# EAGLE design bodeplotter_v1 (EAGLE 9.6.2)

## Sheet 1 of 2: Decoupling caps & peripherals
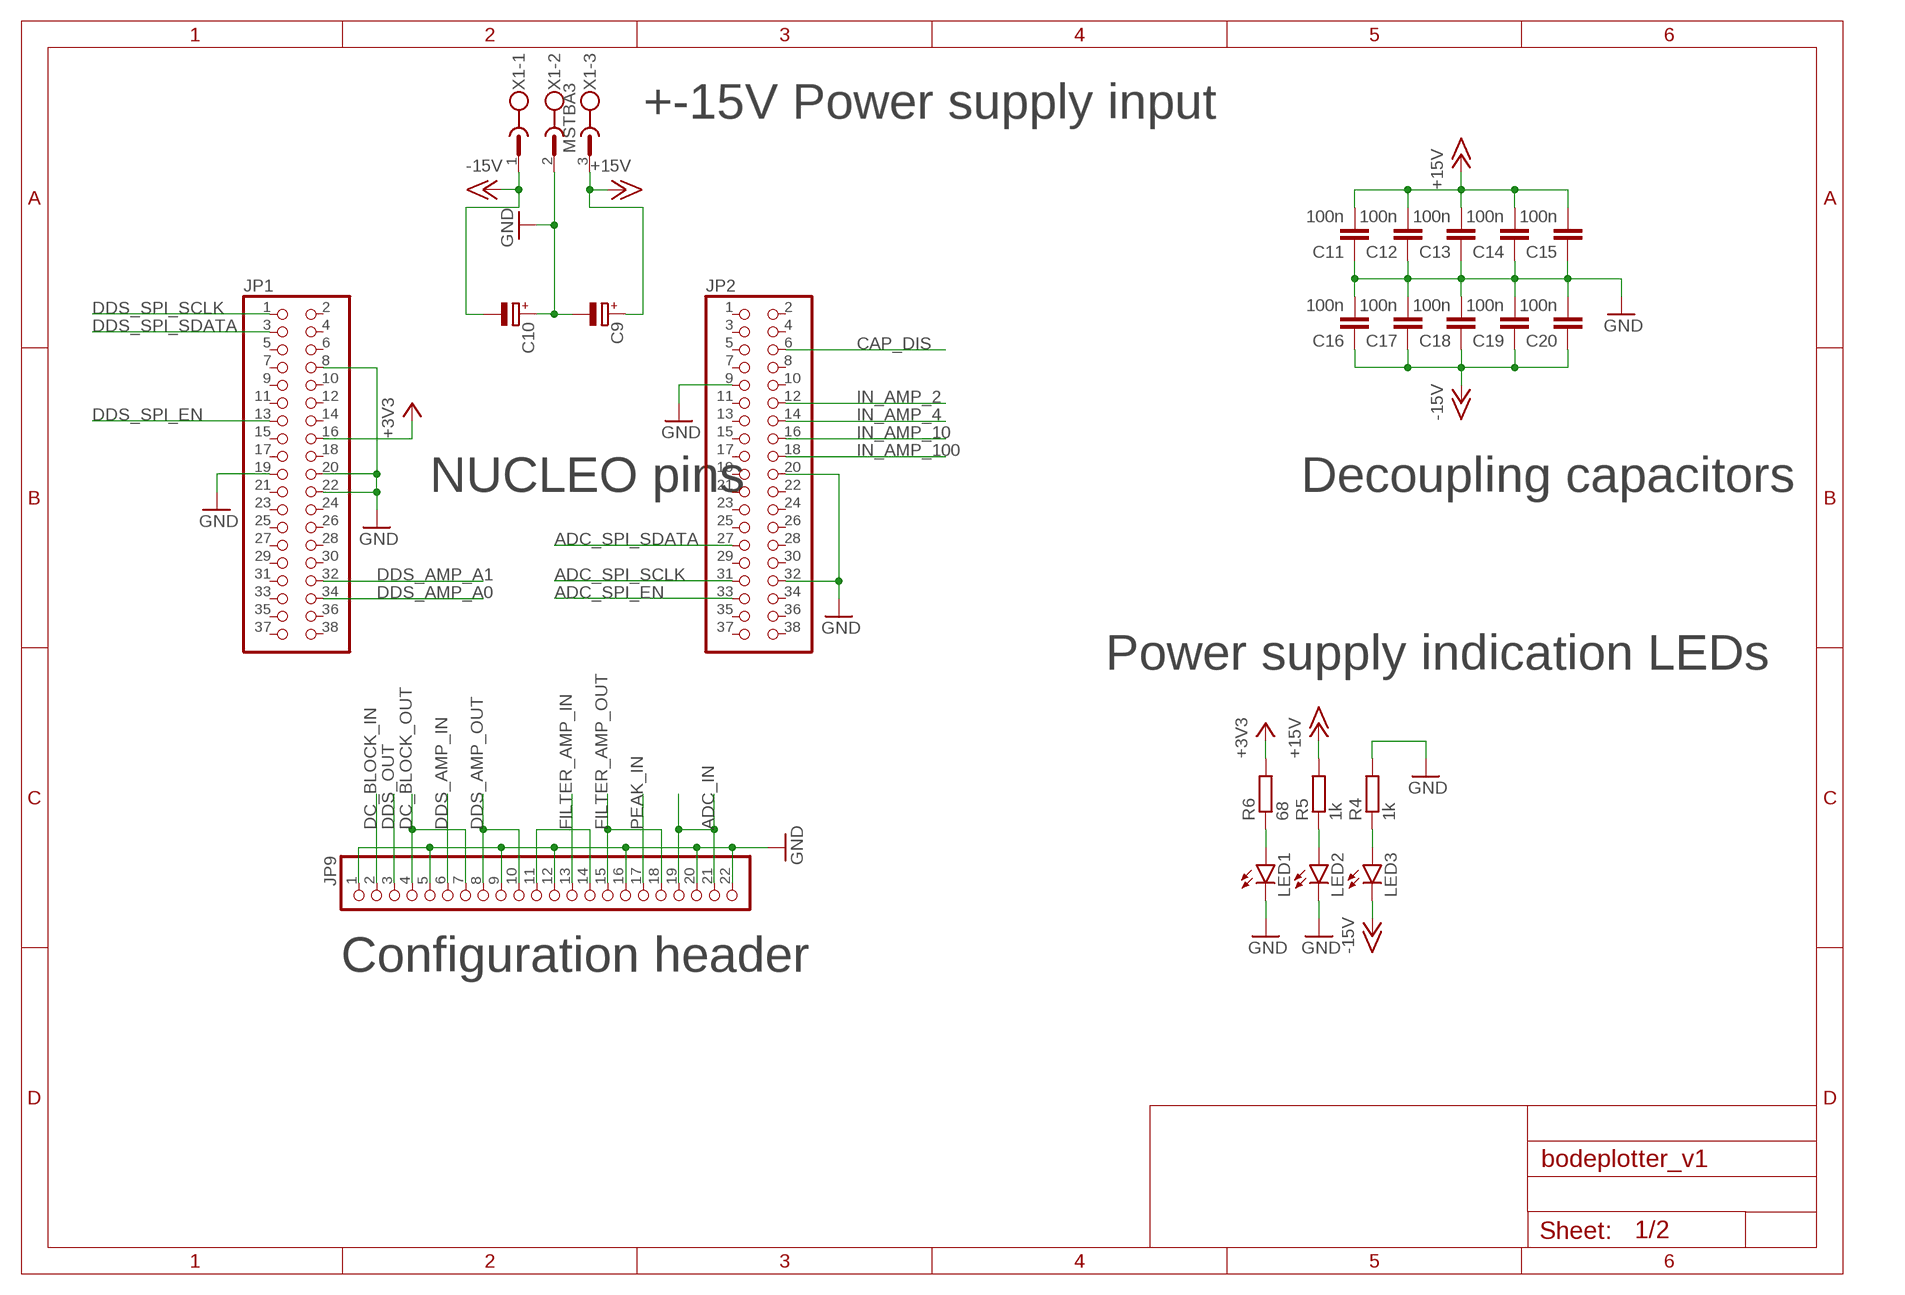
[diagram p0: schematic, sheet 1]

### Parts
C9  CPOL-EU140CLH-0810  [140CLH-0810]
C10  CPOL-EU140CLH-0810  [140CLH-0810]
C11  100n  C-EUC0805  [C0805]
C12  100n  C-EUC0805  [C0805]
C13  100n  C-EUC0805  [C0805]
C14  100n  C-EUC0805  [C0805]
C15  100n  C-EUC0805  [C0805]
C16  100n  C-EUC0805  [C0805]
C17  100n  C-EUC0805  [C0805]
C18  100n  C-EUC0805  [C0805]
C19  100n  C-EUC0805  [C0805]
C20  100n  C-EUC0805  [C0805]
JP1  PINHD-2X19  [2X19]
JP2  PINHD-2X19  [2X19]
JP9  PINHD-1X22  [1X22]
LED1  LEDCHIPLED_1206  [CHIPLED_1206]
LED2  LEDCHIPLED_1206  [CHIPLED_1206]
LED3  LEDCHIPLED_1206  [CHIPLED_1206]
R4  1k  R-EU_R0805  [R0805]
R5  1k  R-EU_R0805  [R0805]
R6  68  R-EU_R0805  [R0805]
X1  MSTBA3  [MSTBA3]

### Nets
+3V3: JP1.16 R6.2 ; also sheet 2
+15V: C9.+ C11.2 C12.2 C13.2 C14.2 C15.2 R5.2 X1.3 ; also sheet 2
-15V: C10.- C16.1 C17.1 C18.1 C19.1 C20.1 LED3.C X1.1 ; also sheet 2
ADC_IN: JP9.19 JP9.21 ; also sheet 2
ADC_SPI_EN: JP2.33 ; also sheet 2
ADC_SPI_SCLK: JP2.31 ; also sheet 2
ADC_SPI_SDATA: JP2.27 ; also sheet 2
CAP_DIS: JP2.6 ; also sheet 2
DC_BLOCK_IN: JP9.2 ; also sheet 2
DC_BLOCK_OUT: JP9.4 JP9.7 ; also sheet 2
DDS_AMP_A0: JP1.34 ; also sheet 2
DDS_AMP_A1: JP1.32 ; also sheet 2
DDS_AMP_IN: JP9.6 ; also sheet 2
DDS_AMP_OUT: JP9.8 JP9.10 ; also sheet 2
DDS_OUT: JP9.3 ; also sheet 2
DDS_SPI_EN: JP1.13 ; also sheet 2
DDS_SPI_SCLK: JP1.1 ; also sheet 2
DDS_SPI_SDATA: JP1.3 ; also sheet 2
FILTER_AMP_IN: JP9.13 ; also sheet 2
FILTER_AMP_OUT: JP9.15 JP9.18 ; also sheet 2
GND: C9.- C10.+ C11.1 C12.1 C13.1 C14.1 C15.1 C16.2 C17.2 C18.2 C19.2 C20.2 JP1.8 JP1.19 JP1.20 JP1.22 JP2.9 JP2.20 JP2.32 JP9.1 JP9.5 JP9.9 JP9.12 JP9.16 JP9.20 JP9.22 LED1.C LED2.C R4.2 X1.2 ; also sheet 2
IN_AMP_2: JP2.12 ; also sheet 2
IN_AMP_4: JP2.14 ; also sheet 2
IN_AMP_10: JP2.16 ; also sheet 2
IN_AMP_100: JP2.18 ; also sheet 2
N$1: LED1.A R6.1
N$4: LED2.A R5.1
N$9: LED3.A R4.1
N$18: JP9.11 JP9.14
PEAK_IN: JP9.17 ; also sheet 2
Unconnected: JP1.2 JP1.4 JP1.5 JP1.6 JP1.7 JP1.9 JP1.10 JP1.11 JP1.12 JP1.14 JP1.15 JP1.17 JP1.18 JP1.21 JP1.23 JP1.24 JP1.25 JP1.26 JP1.27 JP1.28 JP1.29 JP1.30 JP1.31 JP1.33 JP1.35 JP1.36 JP1.37 JP1.38 JP2.1 JP2.2 JP2.3 JP2.4 JP2.5 JP2.7 JP2.8 JP2.10 JP2.11 JP2.13 JP2.15 JP2.17 JP2.19 JP2.21 JP2.22 JP2.23 JP2.24 JP2.25 JP2.26 JP2.28 JP2.29 JP2.30 JP2.34 JP2.35 JP2.36 JP2.37 JP2.38

### Notes on the sheet
- +-15V Power supply input
- NUCLEO pins | Decoupling capacitors
- Power supply indication LEDs
- Configuration header

## Sheet 2 of 2: Parts
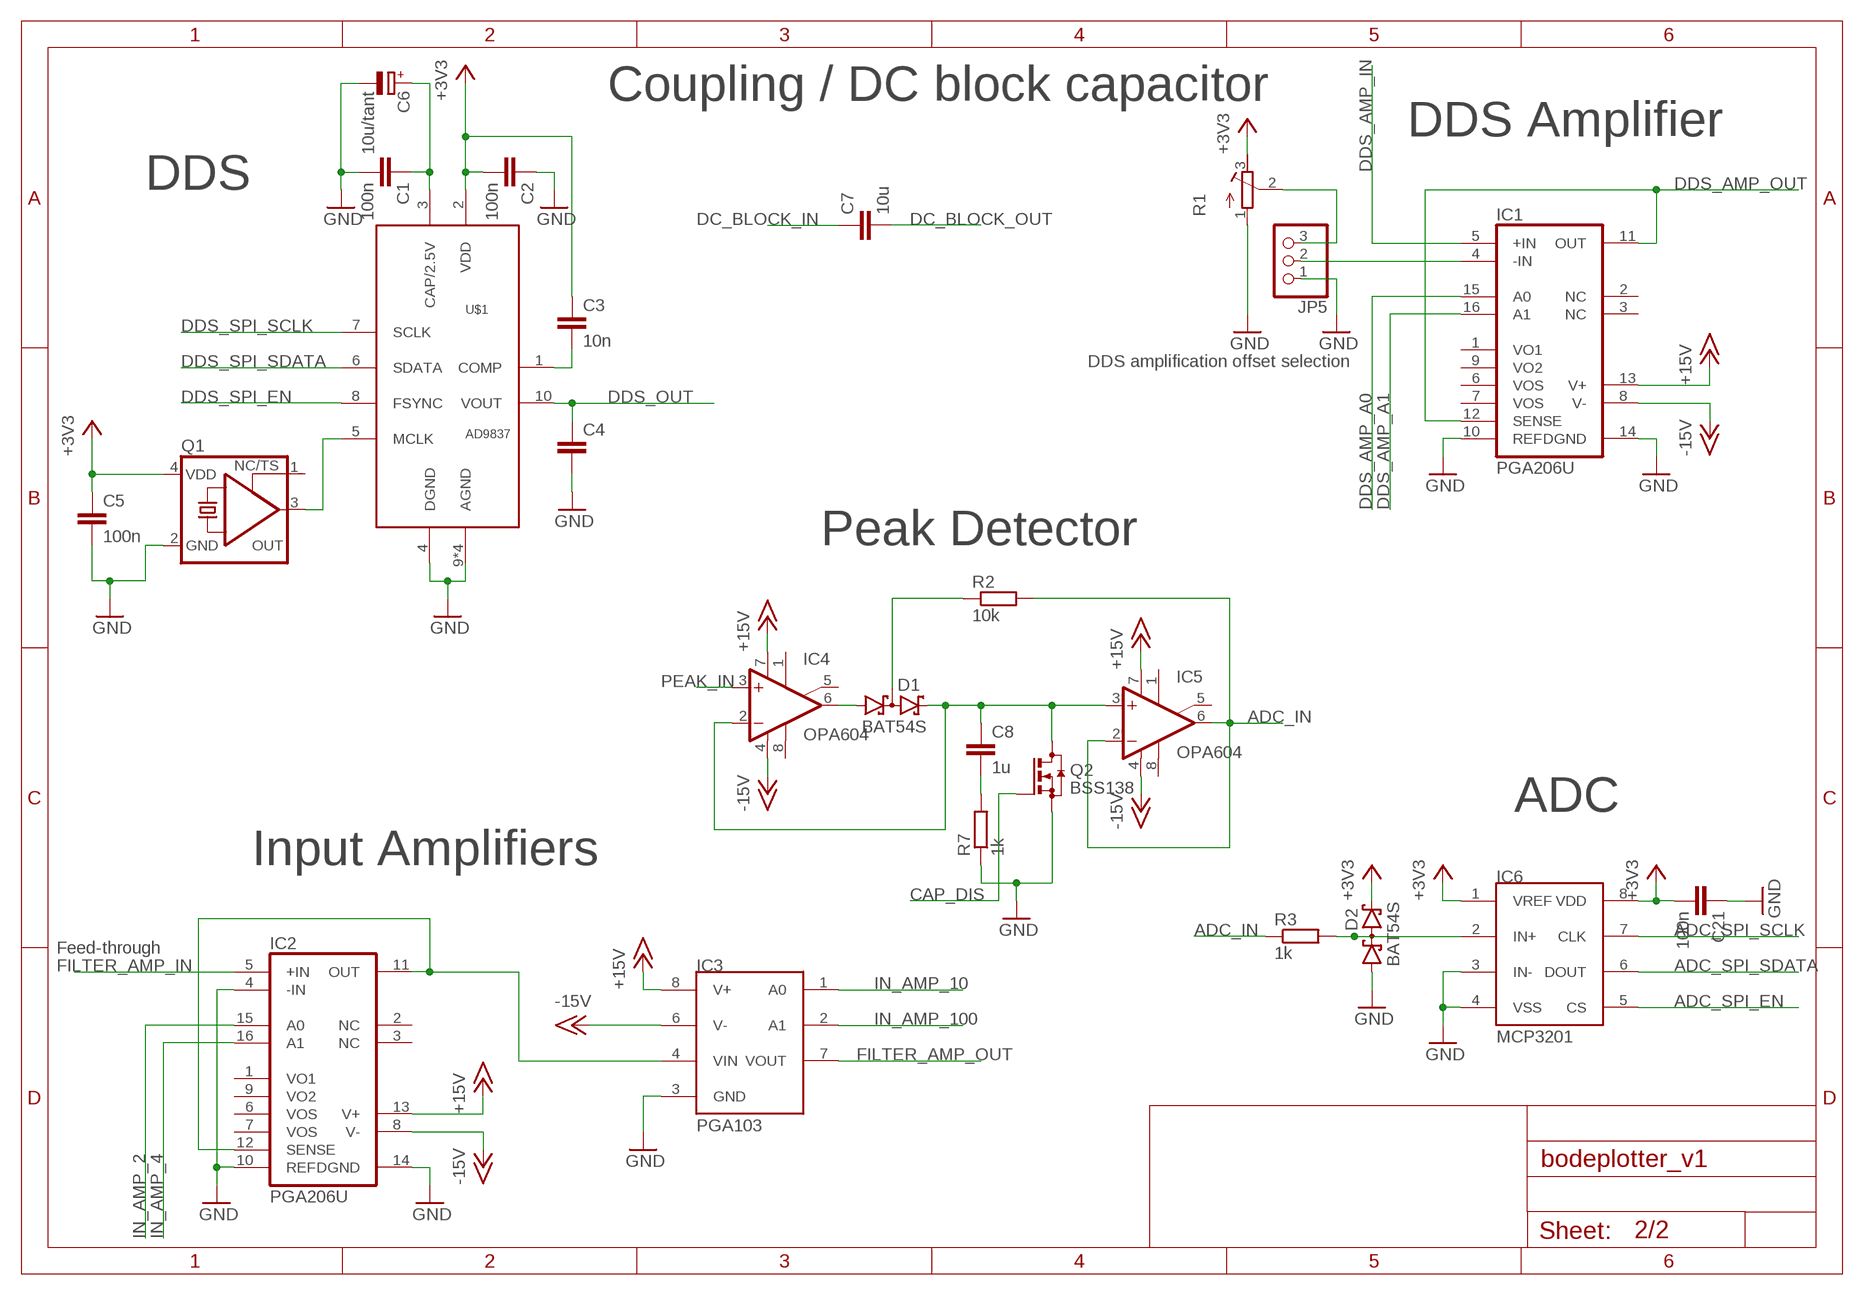
[diagram p1: schematic, sheet 2]

### Parts
C1  100n  C-EUC0805  [C0805]
C2  100n  C-EUC0805  [C0805]
C3  10n  C-EUC0805  [C0805]
C4  C-EUC0805  [C0805]
C5  100n  C-EUC0805  [C0805]
C6  10u/tant  CPOL-EUCT6032  [CT6032]
C7  10u  C-EUC0805  [C0805]
C8  1u  C-EUC0805  [C0805]
C21  100n  C-EUC0805  [C0805]
D1  BAT54S  [SOT23]
D2  BAT54S  [SOT23]
IC1  PGA206U  [SO16-1]
IC2  PGA206U  [SO16-1]
IC3  PGA103  [SOIC8]
IC4  OPA604  OPA606P  [DIL08]
IC5  OPA604  OPA606P  [DIL08]
IC6  MCP3201  [SOIC8]
JP5  PINHD-1X3  [1X03]
Q1  KXO-PXO/XO-V95  [2.5X2.0_KXO-V95]
Q2  BSS138  BSS123  [SOT23]
R1  R-TRIMM64W  [RTRIM64W]
R2  10k  R-EU_R0805  [R0805]
R3  1k  R-EU_R0805  [R0805]
R7  1k  R-EU_R0805  [R0805]
U$1  AD9837  [ANALOG_DEVICES_AD5667BCPZ-R2_2]

### Nets
+3V3: C2.2 C3.1 C5.1 C21.2 D2.2(C2) IC6.1(VREF) IC6.8(VDD) Q1.4(VDD) R1.3(E) U$1.2(VDD) ; also sheet 1
+15V: IC1.13(V+) IC2.13(V+) IC3.8(V+) IC4.7(V+) IC5.7(V+) ; also sheet 1
-15V: IC1.8(V-) IC2.8(V-) IC3.6(V-) IC4.4(V-) IC5.4(V-) ; also sheet 1
ADC_IN: IC5.2(-IN) IC5.6(OUT) R2.2 R3.1 ; also sheet 1
ADC_SPI_EN: IC6.5(CS) ; also sheet 1
ADC_SPI_SCLK: IC6.7(CLK) ; also sheet 1
ADC_SPI_SDATA: IC6.6(DOUT) ; also sheet 1
CAP_DIS: Q2.1(G) ; also sheet 1
DC_BLOCK_IN: C7.1 ; also sheet 1
DC_BLOCK_OUT: C7.2 ; also sheet 1
DDS_AMP_A0: IC1.15(A0) ; also sheet 1
DDS_AMP_A1: IC1.16(A1) ; also sheet 1
DDS_AMP_IN: IC1.5(+IN) ; also sheet 1
DDS_AMP_OUT: IC1.11(OUT) IC1.12(SENSE) ; also sheet 1
DDS_OUT: C4.1 U$1.10(VOUT) ; also sheet 1
DDS_SPI_EN: U$1.8(FSYNC) ; also sheet 1
DDS_SPI_SCLK: U$1.7(SCLK) ; also sheet 1
DDS_SPI_SDATA: U$1.6(SDATA) ; also sheet 1
FILTER_AMP_IN: IC2.5(+IN) ; also sheet 1
FILTER_AMP_OUT: IC3.7(VOUT) ; also sheet 1
GND: C1.2 C2.1 C4.2 C5.2 C6.- C21.1 D2.1(A1) IC1.10(REF) IC1.14(DGND) IC2.4(-IN) IC2.10(REF) IC2.14(DGND) IC3.3(GND) IC6.3(IN-) IC6.4(VSS) JP5.1 Q1.2(GND) Q2.2(S) R1.1(A) R7.1 U$1.4(DGND) U$1.9(AGND) U$1.11(AGND) U$1.PAD_1(AGND) U$1.PAD_2(AGND) ; also sheet 1
IN_AMP_2: IC2.15(A0) ; also sheet 1
IN_AMP_4: IC2.16(A1) ; also sheet 1
IN_AMP_10: IC3.1(A0) ; also sheet 1
IN_AMP_100: IC3.2(A1) ; also sheet 1
N$2: D2.3(C1A2) IC6.2(IN+) R3.2
N$3: C3.2 U$1.1(COMP)
N$5: C1.1 C6.+ U$1.3(CAP/2.5V)
N$6: IC1.4(-IN) JP5.2
N$7: Q1.3(OUT) U$1.5(MCLK)
N$8: JP5.3 R1.2(S)
N$12: C8.2 R7.2
N$14: D1.3(C1A2) R2.1
N$15: IC2.11(OUT) IC2.12(SENSE) IC3.4(VIN)
N$16: D1.1(A1) IC4.6(OUT)
N$19: C8.1 D1.2(C2) IC4.2(-IN) IC5.3(+IN) Q2.3(D)
PEAK_IN: IC4.3(+IN) ; also sheet 1
Unconnected: IC1.1(VO1) IC1.2(NC) IC1.3(NC) IC1.6(VOS) IC1.7(VOS) IC1.9(VO2) IC2.1(VO1) IC2.2(NC) IC2.3(NC) IC2.6(VOS) IC2.7(VOS) IC2.9(VO2) IC4.1(ON1) IC4.5(ON2) IC4.8(OPT) IC5.1(ON1) IC5.5(ON2) IC5.8(OPT) Q1.1(TS)

### Notes on the sheet
- Coupling / DC block capacitor
- DDS Amplifier
- DDS
- DDS amplification offset selection
- Peak Detector
- ADC
- Input Amplifiers
- Feed-through

## Library data of the parts
C1-C5 C7 C8 C11-C21 = rcl:C-EU: CAPACITOR, European symbol; SPICEPREFIX: C
C6 C9 C10 = rcl:CPOL-EU: POLARIZED CAPACITOR, European symbol; SPICEPREFIX: C
D1 D2 = diode:BAT54S: Schottky Diodes Pin connection corrected 2011-05-04 Source: Fairchild .. BAT54.pdf
IC1 IC2 = burr-brown:PGA206: High-Speed Programmable Gain Instrumentation Amplifier; MF: TEXAS INSTRUMENTS; MPN: PGA206UA; OC_FARNELL: unknown; OC_NEWARK: 35C1960
IC3 = personal_lib:PGA103
IC4 IC5 = linear:OPA606: OP AMP
IC6 = personal_lib:MCP3201
JP1 JP2 = pinhead:PINHD-2X19: PIN HEADER
JP5 = pinhead:PINHD-1X3: PIN HEADER
JP9 = pinhead:PINHD-1X22: PIN HEADER
LED1-LED3 = led:LED: LED OSRAM: - CHIPLED LG R971, LG N971, LY N971, LG Q971, LY Q971, LO R971, LY R971 LH N974, LH R974 LS Q976, LO Q976, LY Q976 LO Q996 - Hyper CHIPLED LW Q18S LB Q993, LB Q99A, LB R99A - SideLED LS A670, LO A670, LY A670, LG A670, LP A670 LB A673, LV A673, LT A673, LW A673 LH A674 LY A675 LS A676, LA A676, LO A676, LY A676, LW A676 LS A679, LY A679, LG A679 - Hyper Micro SIDELED® LS Y876, LA Y876, LO Y876, LY Y876 LT Y87S - SmartLED LW L88C, LW L88S LB L89C, LB L89S, LG L890 LS L89K, LO L89K, LY L89K LS L896, LA L896, LO L896, LY L896 - TOPLED LS T670, LO T670, LY T670, LG T670, LP T670 LSG T670, LSP T670, LSY T670, LOP T670, LYG T670 LG T671, LOG T671, LSG T671 LB T673, LV T673, LT T673, LW T673 LH T674 LS T676, LA T676, LO T676, LY T676, LB T676, LH T676, LSB T676, LW T676 LB T67C, LV T67C, LT T67C, LS T67K, LO T67K, LY T67K, LW E67C LS E67B, LA E67B, LO E67B, LY E67B, LB E67C, LV E67C, LT E67C LW T67C LS T679, LY T679, LG T679 LS T770, LO T770, LY T770, LG T770, LP T770 LB T773, LV T773, LT T773, LW T773 LH T774 LS E675, LA E675, LY E675, LS T675 LS T776, LA T776, LO T776, LY T776, LB T776 LHGB T686 LT T68C, LB T68C - Hyper Mini TOPLED® LB M676 - Mini TOPLED Santana® LG M470 LS M47K, LO M47K, LY M47K Source: http://www.osram.convergy.de LUXEON: - LUMILED® LXK2-PW12-R00, LXK2-PW12-S00, LXK2-PW14-U00, LXK2-PW14-V00 LXK2-PM12-R00, LXK2-PM12-S00, LXK2-PM14-U00 LXK2-PE12-Q00, LXK2-PE12-R00, LXK2-PE12-S00, LXK2-PE14-T00, LXK2-PE14-U00 LXK2-PB12-K00, LXK2-PB12-L00, LXK2-PB12-M00, LXK2-PB14-N00, LXK2-PB14-P00, LXK2-PB14-Q00 LXK2-PR12-L00, LXK2-PR12-M00, LXK2-PR14-Q00, LXK2-PR14-R00 LXK2-PD12-Q00, LXK2-PD12-R00, LXK2-PD12-S00 LXK2-PH12-R00, LXK2-PH12-S00 LXK2-PL12-P00, LXK2-PL12-Q00, LXK2-PL12-R00 Source: www.luxeon.com KINGBRIGHT: KA-3528ASYC Source: www.kingbright.com
Q1 = crystal-geyer_V1_0:KXO-PXO/XO-V: Clock Oscillator (PXO/XO) MHz : KXO-V - Serie Model Size l/w/h [mm] Frequency Range Frequency Stability Temp. Range [°C] Output AECQ 200 availabel Datasheet KXO-V94 KXO-V94 KXO-V95 KXO-V95 KXO-V96 KXO-V96 KXO-V99 KXO-V99 KXO-97 KXO-V97 KXO-97 - KXO-V97 2.0/1.6/0.80 2.0/1.6/0.80 2.5/2.0/0.82 2.5/2.0/0.82 3.2/2.5/1.2 3.2/2.5/1.2 5.0/3.2/1.2 5.0/3.2/1.2 7.0/5.08/1.3 7.0/5.08/1.3 7.0/5.08/1.3 32,768 kHz 1,0 ~ 80,0 MHz 32,768 kHz 1,0 ~ 70,0 MHz 32,768 kHz 1,0 ~ 156,0 MHz 32,768 kHz 1,0 ~ 200,0 MHz 32,768 kHz 32,768 kHz 1,0 ~ 160,0 MHz ±25 … ±100ppm ±25 … ±100ppm ±25 … ±100ppm ±25 … ±100ppm ±25 … ±100ppm ±25 … ±100ppm ±25 … ±100ppm ±25 … ±100ppm ±25 … ±100ppm ±25 … ±100ppm ±25 … ±100ppm (*) -40°C …+85°C (*) -40°C …+85°C (*) -40°C …+85°C (*) -40°C …+85°C (*) -40°C …+85°C (*) -40°C …+85°C (*) -40°C …+85°C (*) -40°C …+85°C (*) -40°C …+85°C (*) -40°C …+85°C (*) -40°C …+85°C HCMOS HCMOS HCMOS HCMOS HCMOS HCMOS HCMOS HCMOS HCMOS HCMOS HCMOS - - yes yes yes yes - - - - - KXO-V94-kHz.pdf <http://www.geyer-electronic.de/uploads/tx_userartikelfrequenz/GEYER-KXO-V94-kHz.pdf> KXO-V94.pdf <http://www.geyer-electronic.de/uploads/tx_userartikelfrequenz/GEYER-KXO-V94.pdf> KXO-V95-kHz.pdf <http://www.geyer-electronic.de/uploads/tx_userartikelfrequenz/GEYER-KXO-V95-kHz.pdf> KXO-V95.pdf <http://www.geyer-electronic.de/uploads/tx_userartikelfrequenz/GEYER-KXO-V95.pdf> KXO-V96-kHz.pdf <http://www.geyer-electronic.de/uploads/tx_userartikelfrequenz/GEYER-KXO-V96-kHz.pdf> KXO-V96.pdf <http://www.geyer-electronic.de/uploads/tx_userartikelfrequenz/GEYER-KXO-V96.pdf> KXO-V99-kHz.pdf <http://www.geyer-electronic.de/uploads/tx_userartikelfrequenz/GEYER-KXO-V99-kHz.pdf> KXO-V99.pdf <http://www.geyer-electronic.de/uploads/tx_userartikelfrequenz/GEYER-KXO-V99.pdf> KXO-97-kHz.pdf <http://www.geyer-electronic.de/uploads/tx_userartikelfrequenz/GEYER-KXO-97-kHz.pdf> KXO-V97-kHz.pdf <http://www.geyer-electronic.de/uploads/tx_userartikelfrequenz/GEYER-KXO-V97-kHz.pdf> KXO-V97.pdf <http://www.geyer-electronic.de/uploads/tx_userartikelfrequenz/GEYER-KXO-V97.pdf> <http://www.geyer-electronic.de/fileadmin/template/img/logo-geyer-electronic.png> Details see: http://www.geyer-electronic.de/Frequenz-Produkte.9.0.html Created 2016-06-07, Hans Locher 2016 (C) Geyer Quartz Technology Hans Locher KXOV94,KXOV95;KXOV96;KXOV97;KXO97;2016;2520;3225;5032;70508;2,5x2,0;3,2x2,5;5,0x3,2;7,0x5,08;2.5x2.0;3.2x2.5;5.0x3.2;7.0x5.08;
Q2 = transistor-small-signal:BSS123: N-CHANNEL MOS FET
R1 = rcl:R-TRIMM: Trimm resistor; SPICEMODEL: X; SPICEPREFIXL: POT
R2-R7 = rcl:R-EU_: RESISTOR, European symbol; SPICEPREFIX: R
U$1 = personal_lib:AD9837
X1 = con-phoenix-508:MSTBA3: PHOENIX; MF: FARNELL; MPN: 1757255; OC_FARNELL: 3705183; OC_NEWARK: 71C4162

## Board
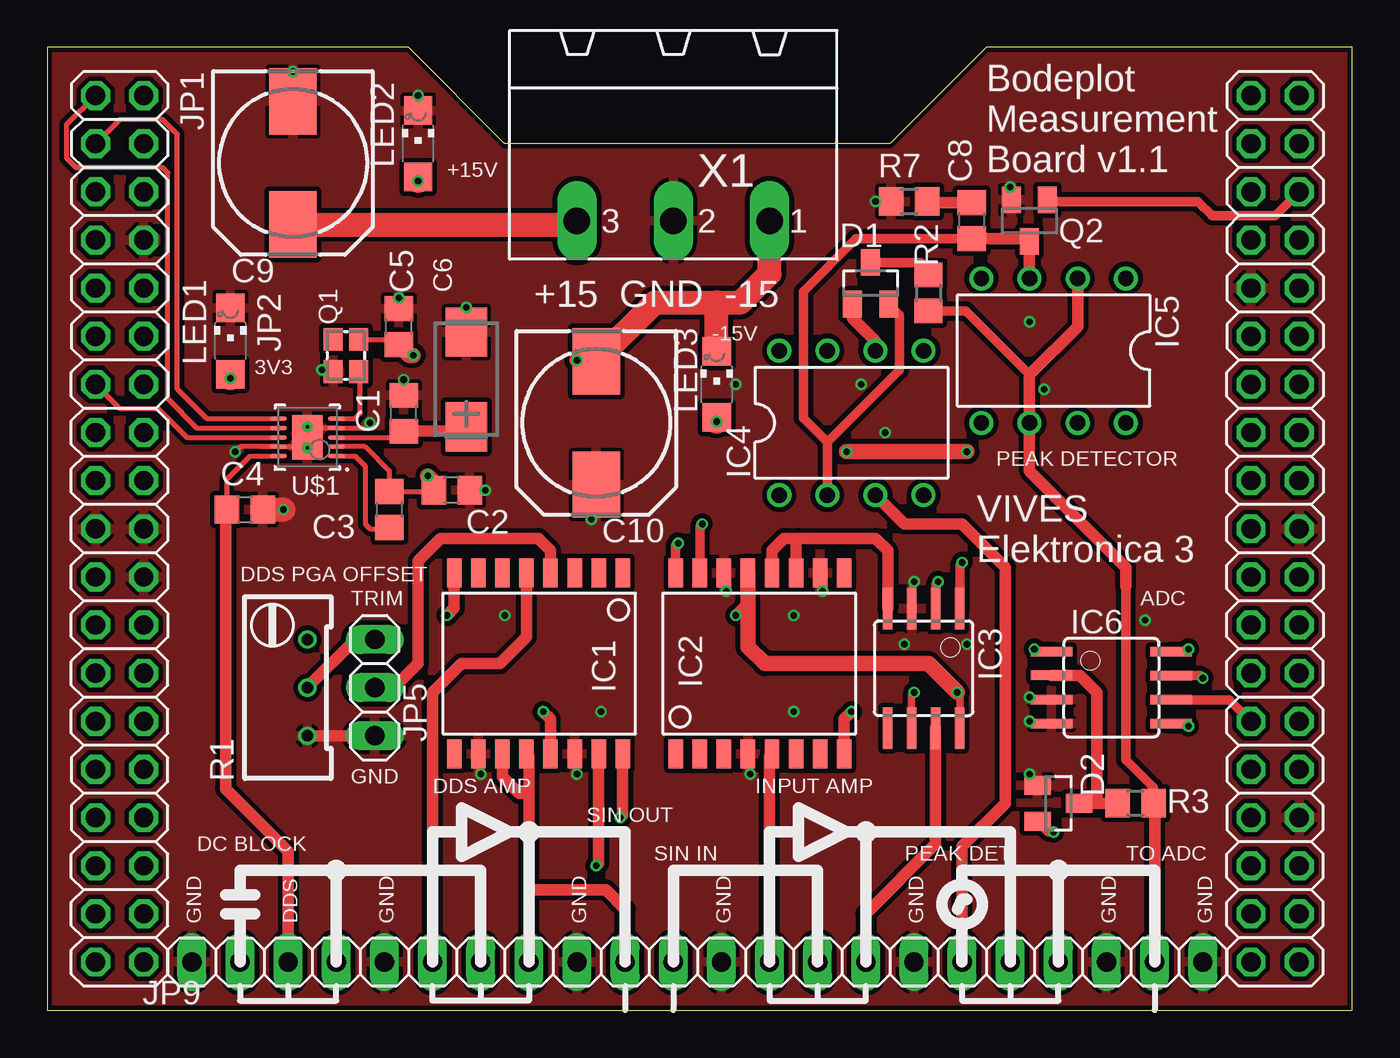
[diagram p2: board, top side]
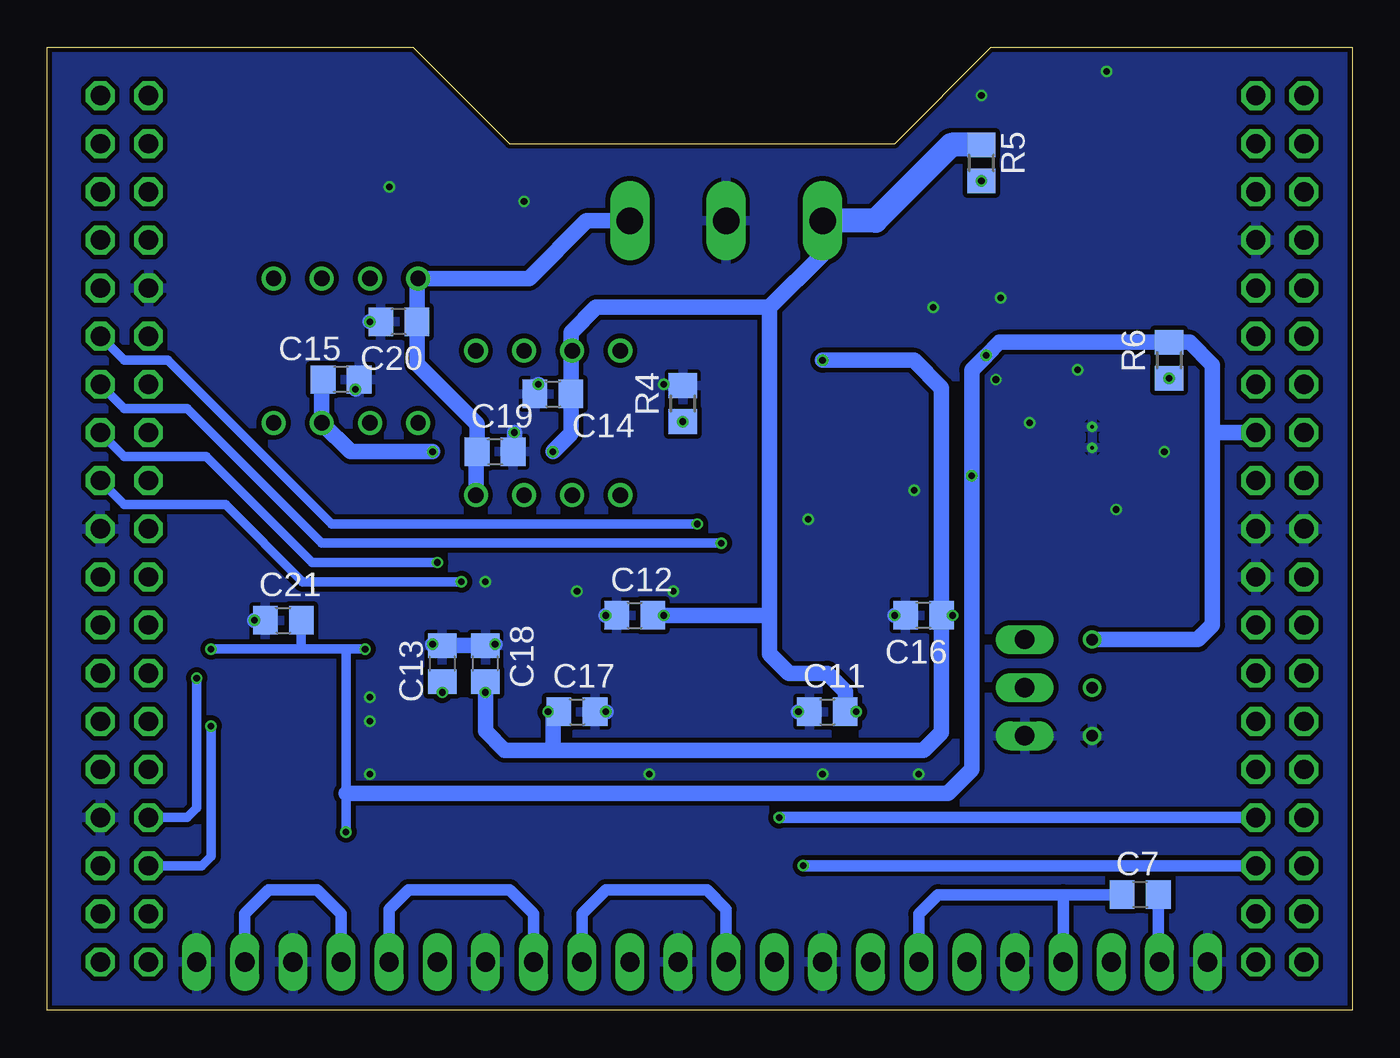
[diagram p3: board, bottom side, seen from below]

Size 68.83 x 50.8 mm. Coordinates in mm from the lower left corner, seen from the top.
Outline: 0,0 68.83,0 68.83,50.8 49.53,50.8 44.45,45.72 24.13,45.72 19.05,50.8 0,50.8 0,0
Copper layers (1*16): Top 0.018mm / dielectric 1.55mm / Bottom 0.018mm
Design rules "eC_2Layer_PClass6_BaseCopperO18_eCDefault": minimum track width 0.15mm, minimum drill 0.35mm, track to track 0.15mm, track to pad 0.15mm, pad to pad 0.15mm, via to via 0.15mm, smd to smd 0mil, copper to edge 0.25mm, drill to drill 0.35mm, minimum pad ring 0.175mm, minimum via ring 0.125mm, stop-mask expansion 0mil, vias tented up to drill 0.45mm, thermal gap 0.2mm

### Footprints (pad centres in the part's own frame; a part is rotated, then mirrored left to right if it is on the bottom)
C0805 = smd 1.3 x 1.5: 1 -0.95,0; 2 0.95,0
CT6032 = smd 2.6 x 2.2: + -2.5,0; - 2.5,0
140CLH-0810 = smd 3.5 x 2.5: + 3.25,0; - -3.25,0
SOT23 = smd 1 x 1.4: 1 -0.95,-1.1; 2 0.95,-1.1; 3 0,1.1
SO16-1 = smd 0.762 x 1.524: 1 -4.445,-4.775; 2 -3.175,-4.775; 3 -1.905,-4.775; 4 -0.635,-4.775; 5 0.635,-4.775; 6 1.905,-4.775; 7 3.175,-4.775; 8 4.445,-4.775; 9 4.445,4.775; 10 3.175,4.775; 11 1.905,4.775; 12 0.635,4.775; 13 -0.635,4.775; 14 -1.905,4.775; 15 -3.175,4.775; 16 -4.445,4.775
SOIC8 = smd 0.5 x 2.2: 1 -1.905,-3.154; 2 -0.645,-3.154; 3 0.625,-3.154; 4 1.895,-3.154; 5 1.905,3.154; 6 0.635,3.154; 7 -0.635,3.154; 8 -1.905,3.154
DIL08 = drill 0.813 pad 1.27: 1 -3.81,-3.81; 2 -1.27,-3.81; 3 1.27,-3.81; 4 3.81,-3.81; 5 3.81,3.81; 6 1.27,3.81; 7 -1.27,3.81; 8 -3.81,3.81
2X19 = drill 1.016 octagon: 1 -22.86,-1.27; 2 -22.86,1.27; 3 -20.32,-1.27; 4 -20.32,1.27; 5 -17.78,-1.27; 6 -17.78,1.27; 7 -15.24,-1.27; 8 -15.24,1.27; 9 -12.7,-1.27; 10 -12.7,1.27; 11 -10.16,-1.27; 12 -10.16,1.27; 13 -7.62,-1.27; 14 -7.62,1.27; 15 -5.08,-1.27; 16 -5.08,1.27; 17 -2.54,-1.27; 18 -2.54,1.27; 19 0,-1.27; 20 0,1.27; 21 2.54,-1.27; 22 2.54,1.27; 23 5.08,-1.27; 24 5.08,1.27; 25 7.62,-1.27; 26 7.62,1.27; 27 10.16,-1.27; 28 10.16,1.27; 29 12.7,-1.27; 30 12.7,1.27; 31 15.24,-1.27; 32 15.24,1.27; 33 17.78,-1.27; 34 17.78,1.27; 35 20.32,-1.27; 36 20.32,1.27; 37 22.86,-1.27; 38 22.86,1.27
1X03 = drill 1.016 long: 1 -2.54,0; 2 0,0; 3 2.54,0
1X22 = drill 1.016 long: 1 -26.67,0; 2 -24.13,0; 3 -21.59,0; 4 -19.05,0; 5 -16.51,0; 6 -13.97,0; 7 -11.43,0; 8 -8.89,0; 9 -6.35,0; 10 -3.81,0; 11 -1.27,0; 12 1.27,0; 13 3.81,0; 14 6.35,0; 15 8.89,0; 16 11.43,0; 17 13.97,0; 18 16.51,0; 19 19.05,0; 20 21.59,0; 21 24.13,0; 22 26.67,0
CHIPLED_1206 = smd 1.5 x 1.5: A 0,-1.75; C 0,1.75
2.5X2.0_KXO-V95 = smd 1.2 x 1: 1 -0.85,-0.675; 2 0.85,-0.675; 3 0.85,0.675; 4 -0.85,0.675
RTRIM64W = drill 0.61: 1 1.27,-2.54; 2 1.27,0; 3 1.27,2.54
R0805 = smd 1.3 x 1.5: 1 -0.95,0; 2 0.95,0
ANALOG_DEVICES_AD5667BCPZ-R2_2 = smd 0.9 x 0.25: 1 -1.525,1; 2 -1.525,0.5; 3 -1.525,0; 4 -1.525,-0.5; 5 -1.525,-1; 6 1.525,-1; 7 1.525,-0.5; 8 1.525,0; 9 1.525,0.5; 10 1.525,1 | smd 1.6 x 2.35: 11 0,0 | drill 0.2 pad 0.5: PAD_1 0,-0.55; PAD_2 0,0.55
MSTBA3 = drill 1.397 long: 1 -5.08,5.08; 2 0,5.08; 3 5.08,5.08

### Placement (x,y rotation side)
C1  18.8,31.5 90 top
C2  21.34,27.43 180 top
C3  18.03,26.42 270 top
C4  10.41,26.42 0 top
C5  18.54,36.07 90 top
C6  22.1,33.27 90 top
C7  11.18,6.1 180 bottom
C8  48.77,41.66 90 top
C9  12.95,44.7 270 top
C10  28.96,30.99 270 top
C11  27.69,15.75 0 bottom
C12  37.85,20.83 0 bottom
C13  48.01,18.29 270 bottom
C14  42.16,32.51 0 bottom
C15  53.34,33.27 180 bottom
C16  22.61,20.83 180 bottom
C17  40.89,15.75 0 bottom
C18  45.72,18.29 90 bottom
C19  45.21,29.46 0 bottom
C20  50.29,36.32 180 bottom
C21  56.39,20.57 0 bottom
D1  43.43,38.35 0 top
D2  53.34,10.92 270 top
IC1  25.91,18.29 180 top
IC2  37.59,18.29 0 top
IC3  46.23,18.03 180 top
IC4  42.42,30.99 0 top
IC5  53.09,34.8 180 top
IC6  56.13,17.02 270 top
JP1  3.81,25.4 270 top
JP2  64.77,25.4 270 top
JP5  17.27,17.02 90 top
JP9  34.29,2.54 0 top
LED1  9.65,35.31 0 top
LED2  19.56,45.72 0 top
LED3  35.31,33.02 0 top
Q1  15.75,34.54 270 top
Q2  51.82,41.66 180 top
R1  12.45,17.02 0 top
R2  46.48,37.85 270 top
R3  57.4,10.92 180 top
R4  35.31,32 90 bottom
R5  19.56,44.7 90 bottom
R6  9.65,34.29 90 bottom
R7  45.47,42.67 0 top
U$1  13.72,30.23 180 top
X1  33.02,46.74 180 top

### Tracks (layer width: path | path; a pad name or v marks a point on that pad's centre or on a via)
+3V3  (via drill 0.35)
  Top 0.254: U$1.2 16.76,29.73 18.03,28.45 C3.1 20.32,27.37 C2.2 | Q1.4 18.27,35.39 C5.1
  Top 0.508: IC6.1 52.2,18.92 v52.07,19.05 | v60.2,19.05 60.07,18.92 IC6.8 | D2.2 52.81,9.4 v53.09,9.4
  Top 0.813: v19.3,34.54 19.12,34.54 C5.1 | v20.07,28.19 20.39,27.87 C2.2
  Bottom 0.508: 53.09,19.05 55.44,19.05 | 55.44,19.05 C21.2 | v60.2,19.05 55.44,19.05 | 53.09,19.05 v52.07,19.05 | v53.09,9.4 53.09,11.43 53.09,19.05
  Bottom 0.813: 7.37,30.48 7.37,34.04 8.57,35.24 R6.2 18.61,35.24 v19.3,34.54 20.07,33.78 v20.07,28.19 20.07,12.7 21.34,11.43 53.09,11.43 | R1.3 8.13,19.56 7.37,20.32 7.37,30.48 | JP1.16 7.37,30.48
+15V  (via drill 0.35)
  Top 0.406: IC3.8 48.13,16.64 v48.01,16.76
  Top 0.61: IC2.13 36.96,21.46 v36.32,20.83 | IC1.13 26.54,15.37 v26.16,15.75
  Top 0.813: v48.51,29.46 v42.16,29.46 | v48.01,16.76 46.48,18.29 37.85,18.29 36.96,19.18 IC2.13
  Top 1.27: C9.+ 27.74,41.45 X1.3
  Bottom 0.406: v48.01,16.76 C13.2
  Bottom 0.61: v36.32,20.83 C12.2 | v26.16,15.75 C11.2
  Bottom 0.813: C15.2 54.36,33.21 IC5.7 52.83,29.46 v48.51,29.46 | 41.21,34.73 C14.2 41.21,30.41 v42.16,29.46 | 41.21,34.73 IC4.7 | 30.73,37.08 27.94,39.88 X1.3 | 30.73,37.08 39.88,37.08 41.21,35.75 41.21,34.73 | C11.2 26.74,16.83 27.69,17.78 29.72,17.78 30.73,18.8 30.73,20.83 | 30.73,37.08 30.73,20.83 | C12.2 30.73,20.83
  Bottom 1.27: R5.2 21.15,45.65 25.15,41.66 X1.3
-15V  (via drill 0.35)
  Top 0.406: IC3.6 45.59,16.64 v45.72,16.76
  Top 0.61: IC2.8 42.04,15.37 v42.42,15.75 | IC1.8 21.46,21.21 v21.08,20.83
  Top 0.813: v27.94,34.29 28.9,34.29 C10.-
  Top 1.27: C10.- 32.06,37.34 35.31,37.34 | 35.31,37.34 36.58,37.34 38.1,38.86 X1.1 | LED3.C 35.31,37.34
  Bottom 0.406: v45.72,16.76 C18.1
  Bottom 0.61: v42.42,15.75 C17.1 | v21.08,20.83 C16.1
  Bottom 0.813: IC4.4 46.23,29.4 C19.1 46.16,30.92 49.34,34.1 C20.1 49.34,38.54 IC5.4 43.43,38.61 40.39,41.66 X1.1 | v27.94,34.29 23.11,34.29 21.66,32.83 C16.1 21.66,14.67 22.61,13.72 42.16,13.72 | 42.16,13.72 44.7,13.72 45.72,14.73 v45.72,16.76 | C17.1 42.16,15.43 42.16,13.72
ADC_IN
  Top 0.508: R3.1 58.35,11.75 56.9,13.21 56.9,22.35 | R2.2 48.45,36.9 51.82,33.53
  Top 0.61: IC5.2 54.36,36.07 51.82,33.53 IC5.6 51.82,28.45 56.9,23.37 56.9,22.35 | JP9.21 58.42,10.86 R3.1
  Bottom 0.61: JP9.19 53.34,5.08 54.61,6.35 57.15,6.35 58.42,5.08 JP9.21
ADC_SPI_EN  (via drill 0.35)
  Top 0.508: IC6.5 60.07,15.11 v60.2,14.99
  Bottom 0.508: JP2.33 60.71,7.62 60.2,8.13 v60.2,14.99
ADC_SPI_SCLK  (via drill 0.35)
  Top 0.508: IC6.7 60.83,17.65 v60.96,17.53
  Bottom 0.508: JP2.31 61.47,10.16 60.96,10.67 v60.96,17.53
ADC_SPI_SDATA
  Top 0.508: JP2.27 62.36,16.38 IC6.6
CAP_DIS
  Top 0.508: Q2.1 52.85,42.67 60.71,42.67 61.47,41.91 64.77,41.91 JP2.6
DC_BLOCK_IN
  Bottom 0.61: C7.1 10.23,2.61 JP9.2
DC_BLOCK_OUT
  Bottom 0.61: JP9.7 22.86,5.08 21.84,6.1 15.24,6.1 | 15.24,6.1 C7.2 | JP9.4 15.24,6.1
DDS_AMP_A0  (via drill 0.35)
  Top 0.61: IC1.15 29.08,7.75 v28.96,7.62
  Bottom 0.61: JP1.34 v28.96,7.62
DDS_AMP_A1  (via drill 0.35)
  Top 0.61: IC1.16 30.35,10.29 v30.23,10.16
  Bottom 0.61: JP1.32 v30.23,10.16
DDS_AMP_IN
  Top 0.61: IC1.5 25.27,19.68 23.88,18.29 21.84,18.29 20.32,16.76 JP9.6
DDS_AMP_OUT
  Top 0.61: JP9.8 25.4,6.35 | JP9.10 30.48,5.33 29.46,6.35 25.4,6.35 | IC1.12 25.4,13.39 25.4,11.43 | 25.4,6.35 25.4,11.43 | IC1.11 24,12.32 24.89,11.43 25.4,11.43
DDS_OUT
  Top 0.254: U$1.10 12.18,29.21 10.67,29.21 9.46,28.01 C4.1
  Top 0.61: JP9.3 12.7,8.38 9.4,11.68 9.4,26.35 C4.1
DDS_SPI_EN
  Top 0.254: U$1.8 7.37,30.23 5.84,31.75 3.81,31.75 JP1.13
DDS_SPI_SCLK
  Top 0.254: JP1.1 1.02,46.74 1.02,44.96 1.52,44.45 6.1,44.45 6.35,44.2 6.35,32.26 7.88,30.73 U$1.7
DDS_SPI_SDATA
  Top 0.254: JP1.3 3.81,46.99 6.1,46.99 6.86,46.23 6.86,32.77 8.4,31.23 U$1.6
FILTER_AMP_IN
  Top 0.61: IC2.5 38.1,13.39 JP9.13
FILTER_AMP_OUT
  Top 0.61: IC3.7 46.86,8.76 43.18,5.08 JP9.15
  Bottom 0.61: JP9.15 43.18,5.08 44.45,6.35 49.78,6.35 50.8,5.33 JP9.18
GND  (via drill 0.35)
  Top 0.254: 13.2,29.73 U$1.9 10.17,29.73 v9.91,29.46 | 14.23,30.73 U$1.4 16.76,30.73 v17.02,30.99 | C1.2 v18.8,33.27 | Q1.2 14.98,33.78 v14.48,33.78 | C5.2 v18.54,37.59 | C6.- v22.1,37.08 | C9.- v12.95,49.53 | LED2.C v19.56,48.26 | R7.1 v43.69,42.67 | Q2.2 50.87,43.37 v50.8,43.43 | C2.1 v23.11,27.43 | C10.+ 28.7,27.48 v28.7,25.91 | IC1.14 27.81,12.57 v27.94,12.45 | IC1.10 22.73,12.57 v22.86,12.45 | IC2.4 36.96,12.57 v37.08,12.45 | IC2.14 35.69,22.23 v35.81,22.1 | IC2.10 40.89,22.94 v40.89,22.1 | IC3.3 45.6,22.49 v45.72,22.61 | IC6.4 51.93,15.12 v51.82,15.24 | IC6.3 52.86,16.51 v51.82,16.51 | D2.1 51.82,12.3 v51.82,12.45
  Top 0.61: JP5.1 R1.1
  Top 1.27: C4.2 v12.45,26.42
  Bottom 0.254: R4.2 36.26,32.95 v36.32,33.02
  Bottom 0.813: C16.2 v24.13,20.83 | C11.1 v29.21,15.75 | C12.1 v39.37,20.83 | C17.2 v39.37,15.75 | v45.21,19.3 45.65,19.3 C18.2 C13.1 48.45,19.24 v48.51,19.3 | C21.1 v57.91,20.57 | C19.2 44.2,29.53 v44.2,30.48 | C14.1 43.11,32.83 v42.93,33.02 | C15.1 52.58,33.09 v52.58,32.77 | C20.2 v51.82,36.32
  pour Top (isolate 0.254): 0,50.8 19.05,50.8 24.13,45.72 44.7,45.72 49.78,50.8 68.83,50.8 68.83,0 0,0
  pour Bottom (isolate 0.254): 0,50.8 19.05,50.8 24.13,45.72 44.7,45.72 49.78,50.8 68.83,50.8 68.83,0 0,0
IN_AMP_2  (via drill 0.35)
  Top 0.508: IC2.15 34.42,25.53 v34.54,25.65
  Bottom 0.508: JP2.12 64.77,34.29 62.48,34.29 53.85,25.65 v34.54,25.65
IN_AMP_4  (via drill 0.35)
  Top 0.508: IC2.16 33.15,24.51 v33.27,24.64
  Bottom 0.508: JP2.14 64.77,31.75 61.47,31.75 54.36,24.64 v33.27,24.64
IN_AMP_10  (via drill 0.35)
  Top 0.508: IC3.1 48.13,23.5 v48.26,23.62
  Bottom 0.508: JP2.16 64.77,29.21 60.45,29.21 54.86,23.62 v48.26,23.62
IN_AMP_100  (via drill 0.35)
  Top 0.508: IC3.2 46.87,22.49 v46.99,22.61
  Bottom 0.508: JP2.18 64.77,26.67 59.44,26.67 55.37,22.61 v46.99,22.61
N$1  (via drill 0.35)
  Top 1.27: LED1.A R6.1
  other vias: 9.65,33.34
N$2
  Top 0.61: IC6.2 54.47,17.66 55.37,16.76 55.37,10.92 R3.2 D2.3
N$3
  Top 0.254: U$1.1 16.24,29.23 16.76,28.7 16.76,25.65 17.02,25.4 17.97,25.4 C3.2
N$4  (via drill 0.35)
  Top 1.27: R5.1 LED2.A
  other vias: 19.56,43.75
N$5
  Top 0.254: U$1.3 18.48,30.23 C1.1
  Top 0.61: C1.1 21.87,30.55 C6.+
N$6
  Top 0.61: JP5.2 18.29,17.02 19.56,18.29 19.56,23.7 20.75,24.89 25.91,24.89 26.54,24.26 IC1.4
N$7
  Top 0.254: U$1.5 16.24,31.23 16.51,31.5 16.51,33.61 Q1.3
N$8
  Top 0.61: R1.2 16.26,19.56 JP5.3
N$9  (via drill 0.35)
  Top 1.27: R4.1 LED3.A
  other vias: 35.31,31.05
N$12
  Top 0.61: C8.2 46.36,42.61 R7.2
N$14
  Top 0.508: R2.1 46.48,39.05 46.08,39.45 D1.3
N$15
  Top 0.61: IC2.12 38.23,24.26 38.86,24.89 39.62,24.89 | 39.62,24.89 43.69,24.89 44.33,24.25 IC3.4 | IC2.11 39.5,24.77 39.62,24.89
N$16
  Top 0.61: D1.1 42.48,36.51 43.69,35.31 IC4.6
N$18
  Bottom 0.61: JP9.11 33.02,5.33 34.04,6.35 39.37,6.35 40.64,5.08 JP9.14
N$19
  Top 0.508: IC4.2 41.15,29.97 | 41.15,29.97 44.96,33.78 44.96,36.68 D1.2 | C8.1 42.66,40.71 39.88,37.92 39.88,31.24 41.15,29.97
  Top 0.61: IC5.3 Q2.3 51.67,40.71 C8.1
PEAK_IN
  Top 0.61: JP9.17 48.26,8.64 50.55,10.92 50.55,23.37 48.26,25.65 45.21,25.65 IC4.3

### Text on the board
tPlace: +15V | Bodeplot / Measurement / Board v1.1 | +15 GND -15 | -15V | 3V3 | PEAK DETECTOR | VIVES / Elektronica 3 | DDS PGA OFFSET | TRIM | ADC | GND | DDS AMP | INPUT AMP | SIN OUT | DC BLOCK | SIN IN | PEAK DET | TO ADC | GND | DDS | GND | GND | GND | GND | GND | GND